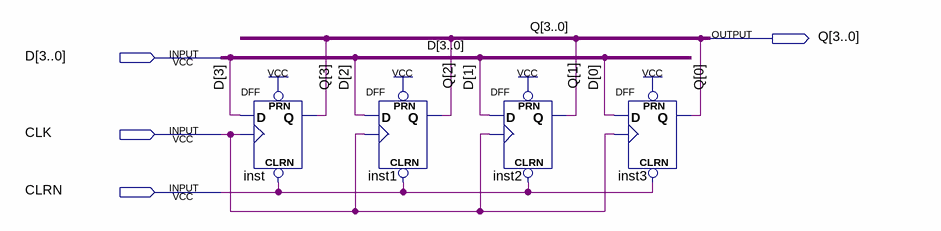
[diagram p0: schematic sheet]
// Quartus schematic REGISTER_PIPO_4BITS.bdf as structural Verilog: 4 symbols, 4 pins
module REGISTER_PIPO_4BITS (
  input  [3:0] D,
  input  CLK,
  input  CLRN,
  output [3:0] Q
);

  DFF inst (.CLRN(CLRN), .CLK(CLK), .D(D[3]), .PRN(1'b1), .Q(Q[3]));
  DFF inst1 (.CLRN(CLRN), .CLK(CLK), .D(D[2]), .PRN(1'b1), .Q(Q[2]));
  DFF inst2 (.CLRN(CLRN), .CLK(CLK), .D(D[1]), .PRN(1'b1), .Q(Q[1]));
  DFF inst3 (.CLRN(CLRN), .CLK(CLK), .D(D[0]), .PRN(1'b1), .Q(Q[0]));
endmodule
